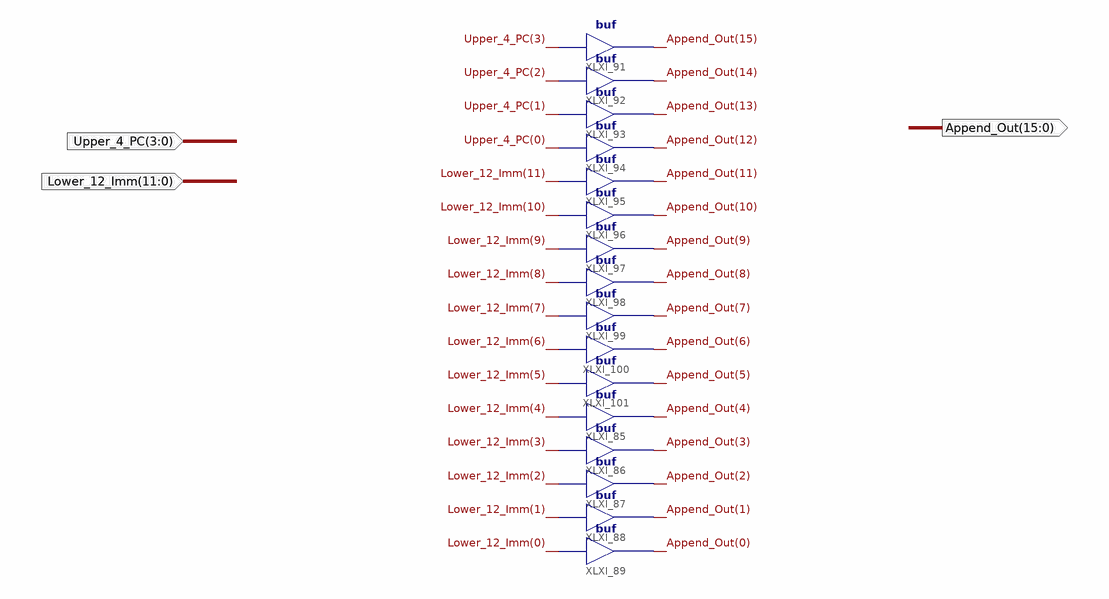
[diagram p0: schematic sheet 1]
// Xilinx ISE schematic Append_Buffer.sch (spartan3e) as structural Verilog: 16 symbols, 3 ports
module Append_Buffer (
  input  [3:0] Upper_4_PC,
  input  [11:0] Lower_12_Imm,
  output [15:0] Append_Out
);

  buf XLXI_85 (Append_Out[4], Lower_12_Imm[4]);
  buf XLXI_86 (Append_Out[3], Lower_12_Imm[3]);
  buf XLXI_87 (Append_Out[2], Lower_12_Imm[2]);
  buf XLXI_88 (Append_Out[1], Lower_12_Imm[1]);
  buf XLXI_89 (Append_Out[0], Lower_12_Imm[0]);
  buf XLXI_91 (Append_Out[15], Upper_4_PC[3]);
  buf XLXI_92 (Append_Out[14], Upper_4_PC[2]);
  buf XLXI_93 (Append_Out[13], Upper_4_PC[1]);
  buf XLXI_94 (Append_Out[12], Upper_4_PC[0]);
  buf XLXI_95 (Append_Out[11], Lower_12_Imm[11]);
  buf XLXI_96 (Append_Out[10], Lower_12_Imm[10]);
  buf XLXI_97 (Append_Out[9], Lower_12_Imm[9]);
  buf XLXI_98 (Append_Out[8], Lower_12_Imm[8]);
  buf XLXI_99 (Append_Out[7], Lower_12_Imm[7]);
  buf XLXI_100 (Append_Out[6], Lower_12_Imm[6]);
  buf XLXI_101 (Append_Out[5], Lower_12_Imm[5]);
endmodule
